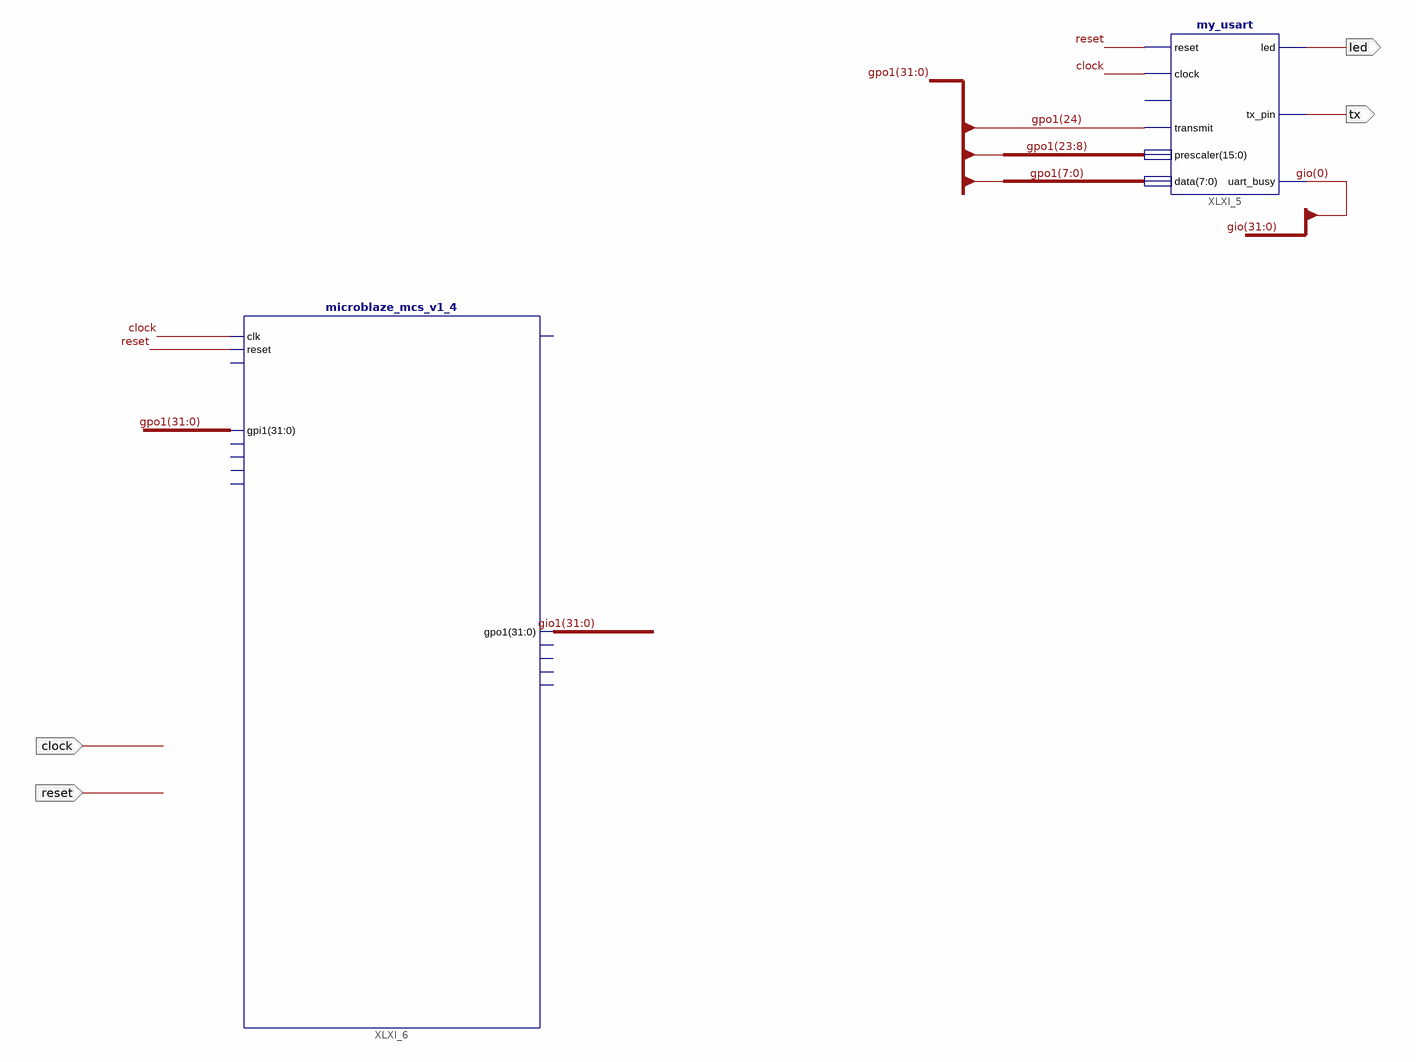
[diagram p0: schematic sheet 1]
// Xilinx ISE schematic schematic_src_1.sch (spartan6) as structural Verilog: 2 symbols, 4 ports
module schematic_src_1 (
  input  reset,
  input  clock,
  output tx,
  output led
);

  wire [0:0] gio;
  wire [31:0] gio1, gpo1;

  my_usart XLXI_5 (
    .reset(reset), .clock(clock), .transmit(gpo1[24]), .prescaler(gpo1[23:8]), .data(gpo1[7:0]), .led(led),
    .tx_pin(tx), .uart_busy(gio[0]));  // open: rx_pin
  microblaze_mcs_v1_4 XLXI_6 (
    .clk(clock), .reset(reset), .gpi1(gpo1), .gpo1(gio1));  // open: uart_tx, uart_rx, gpi2, gpi3, gpi4, gpo2, gpo3, gpo4, intc_irq, intc_interrupt
endmodule
